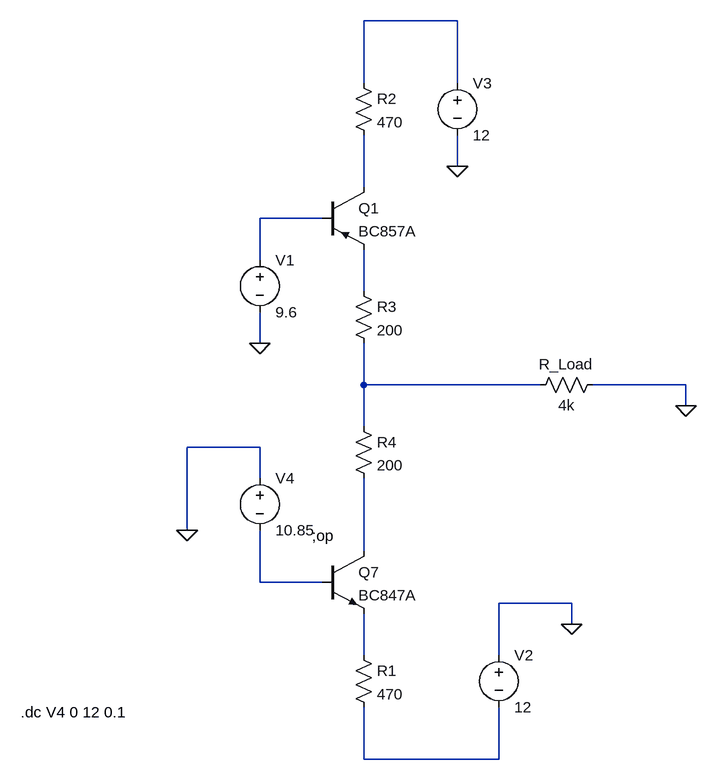
[diagram p0: schematic v2.asc]
v2.asc, the LTspice schematic file:
Version 4
SHEET 1 1236 1492
WIRE 272 -16 128 -16
WIRE 128 80 128 -16
WIRE 272 80 272 -16
WIRE 272 208 272 160
WIRE 128 240 128 160
WIRE 64 288 -32 288
WIRE -32 352 -32 288
WIRE 128 400 128 336
WIRE -32 480 -32 432
WIRE 128 544 128 480
WIRE 400 544 128 544
WIRE 624 544 480 544
WIRE 624 576 624 544
WIRE 128 608 128 544
WIRE -32 640 -144 640
WIRE -32 688 -32 640
WIRE -144 768 -144 640
WIRE 128 800 128 688
WIRE -32 848 -32 768
WIRE 64 848 -32 848
WIRE 448 880 336 880
WIRE 448 912 448 880
WIRE 128 960 128 896
WIRE 336 960 336 880
WIRE 128 1120 128 1040
WIRE 336 1120 336 1040
WIRE 336 1120 128 1120
FLAG -32 480 0
FLAG 624 576 0
FLAG 448 912 0
FLAG 272 208 0
FLAG -144 768 0
SYMBOL voltage -32 336 R0
WINDOW 123 0 0 Left 0
WINDOW 39 0 0 Left 0
SYMATTR InstName V1
SYMATTR Value 9.6
SYMBOL npn 64 800 R0
SYMATTR InstName Q7
SYMATTR Value BC847A
SYMBOL res 112 944 R0
SYMATTR InstName R1
SYMATTR Value 470
SYMBOL res 496 528 R90
WINDOW 0 0 56 VBottom 2
WINDOW 3 32 56 VTop 2
SYMATTR InstName R_Load
SYMATTR Value 4k
SYMBOL voltage 336 944 R0
WINDOW 123 0 0 Left 0
WINDOW 39 0 0 Left 0
SYMATTR InstName V2
SYMATTR Value 12
SYMBOL pnp 64 240 R0
SYMATTR InstName Q1
SYMATTR Value BC857A
SYMBOL res 112 64 R0
SYMATTR InstName R2
SYMATTR Value 470
SYMBOL voltage 272 64 R0
WINDOW 123 0 0 Left 0
WINDOW 39 0 0 Left 0
SYMATTR InstName V3
SYMATTR Value 12
SYMBOL voltage -32 672 R0
WINDOW 123 0 0 Left 0
WINDOW 39 0 0 Left 0
SYMATTR InstName V4
SYMATTR Value 10.85
SYMBOL res 112 384 R0
SYMATTR InstName R3
SYMATTR Value 200
SYMBOL res 112 592 R0
SYMATTR InstName R4
SYMATTR Value 200
TEXT 48 776 Left 2 !;op
TEXT -400 1048 Left 2 !.dc V4 0 12 0.1

The netlist it stands for:
* v2.asc
V1 N003 0 9.6
Q7 N006 N007 N008 0 BC847A
R1 N008 N009 470
R_Load 0 N005 4k
V2 0 N009 12
Q1 N002 N003 N004 0 BC857A
R2 N001 N002 470
V3 N001 0 12
V4 0 N007 10.85
R3 N004 N005 200
R4 N005 N006 200
.model NPN NPN
.model PNP PNP
.lib standard.bjt
;op
.dc V4 0 12 0.1
.backanno
.end